# Altium schematic sheet External_Camera_HAT_Connectors.SchDoc: Connectors
size B; Date: 12/28/2023; Author: Robert Pafford; Organization: ORGANIZATION; Address1: ADDRESS 1; Address2: ADDRESS 2; Address3: ADDRESS 3; Address4: ADDRESS 4; Revision: -; SheetNumber: 1; SheetTotal: 4; ENG_APP_DATE: --/--/--; DSN_APP_DATE: --/--/--; CHK_APP_DATE: --/--/--
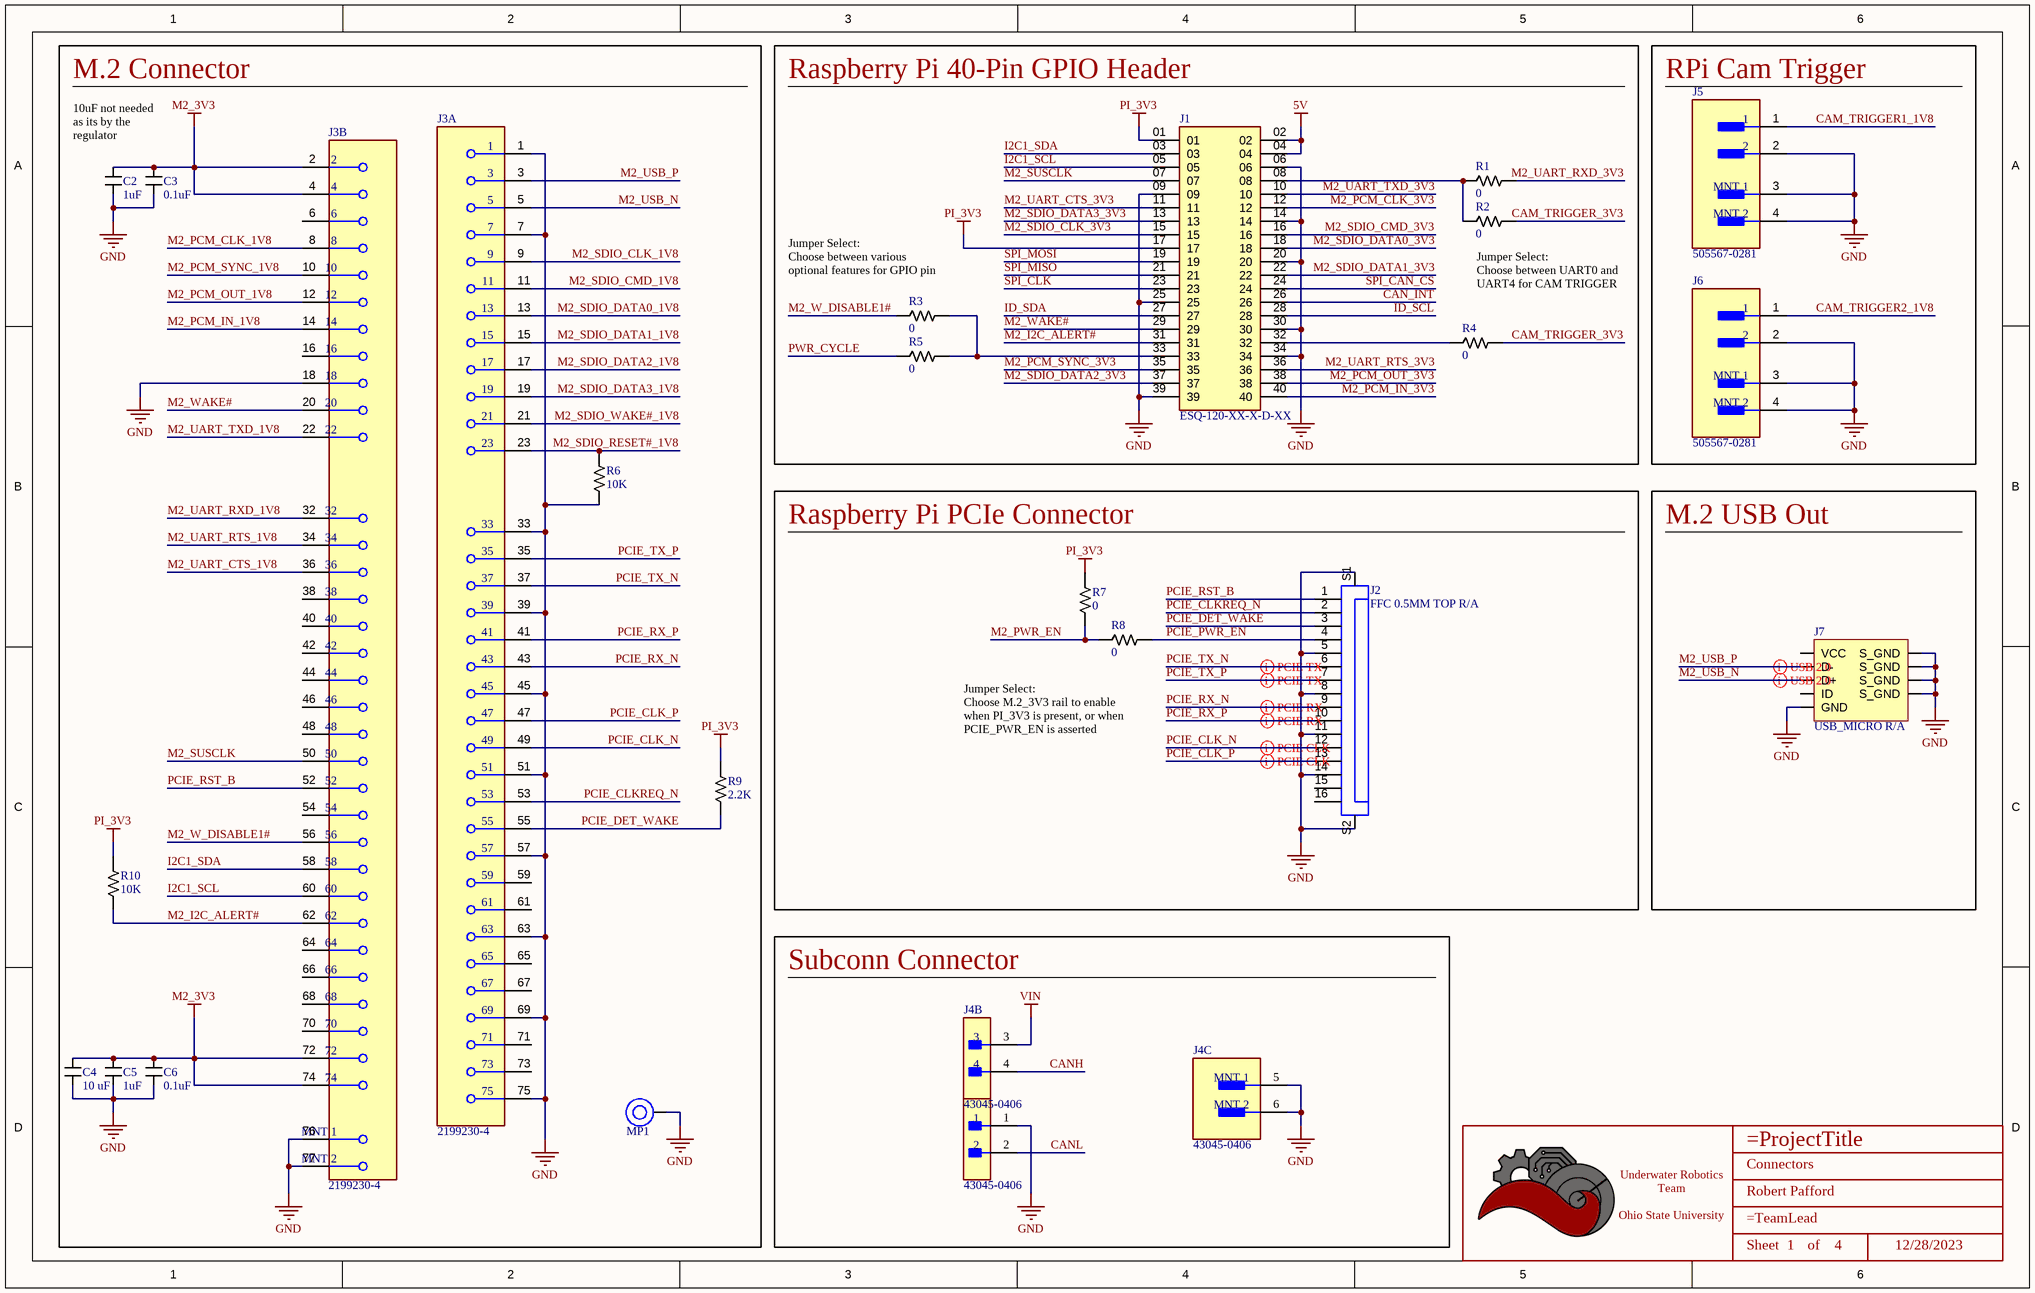
[diagram p0: External_Camera_HAT_Connectors.SchDoc]

## Parts
*  Title_Block  [LOGO]  (value not drawn)  (graphical)
C2  value 1uF  [CAPACITOR_0402]  (hidden comment: 1uF Ceramic 16V)
C3  value 0.1uF  [CAPACITOR_0402]  (hidden comment: 100nF Ceramic 25V)
C4  Value (uF): 10 uF  [CAPACITOR_0603]  (hidden comment: 10uF Ceramic 6.3V)
C5  value 1uF  [CAPACITOR_0402]  (hidden comment: 1uF Ceramic 16V)
C6  value 0.1uF  [CAPACITOR_0402]  (hidden comment: 100nF Ceramic 25V)
J1  ESQ-120-XX-X-D-XX  [SAMTEC_ESQ-120-XX-X-D-XX]
J2  FFC 0.5MM TOP R/A  [FH12A-16S-0.5SH(55)]
J3  2199230-4  [FP-2199230-4-MFG]  (parts A,B of 2)
J4  43045-0406  [FP-43045-0406-MFG]  (parts A,B,C of 3)
J5  505567-0281  [FP-505567-0281-MFG]
J6  505567-0281  [FP-505567-0281-MFG]
J7  USB_MICRO R/A  [CONN_MINIUSB]
MP1  M3 x 2.5mm  [78614025360]  (value not drawn)
R1  Value  (Ohms): 0  [RESISTOR_0402]  (hidden comment: 0 Ohm 1% 1/16W)
R2  Value  (Ohms): 0  [RESISTOR_0402]  (hidden comment: 0 Ohm 1% 1/16W)
R3  Value  (Ohms): 0  [RESISTOR_0402]  (hidden comment: 0 Ohm 1% 1/16W)
R4  Value  (Ohms): 0  [RESISTOR_0402]  (hidden comment: 0 Ohm 1% 1/16W)
R5  Value  (Ohms): 0  [RESISTOR_0402]  (hidden comment: 0 Ohm 1% 1/16W)
R6  Value  (Ohms): 10K  [RESISTOR_0402]  (hidden comment: 10k Ohm 1% 1/16W)
R7  Value  (Ohms): 0  [RESISTOR_0402]  (hidden comment: 0 Ohm 1% 1/16W)
R8  Value  (Ohms): 0  [RESISTOR_0402]  (hidden comment: 0 Ohm 1% 1/16W)
R9  Value  (Ohms): 2.2K  [RESISTOR_0402]  (hidden comment: 2.2k Ohm 1% 1/16W)
R10  Value  (Ohms): 10K  [RESISTOR_0402]  (hidden comment: 10k Ohm 1% 1/16W)

## Blocks framed on the sheet
M.2 Connector: C2-C6 J3 MP1 R6 R9 R10
Raspberry Pi 40-Pin GPIO Header: J1 R1-R5
RPi Cam Trigger: J5 J6
Raspberry Pi PCIe Connector: J2 R7 R8
M.2 USB Out: J7
Subconn Connector: J4

## Nets
5V: J1.02 J1.04
GND: C2.2 C3.2 C4.2 C5.2 C6.2 J1.06 J1.09 J1.14 J1.20 J1.25 J1.30 J1.34 J1.39 J2.5 J2.8 J2.11 J2.14 J2.S1 J2.S2 J3.1 J3.7 J3.18 J3.33 J3.39 J3.45 J3.51 J3.57 J3.63 J3.69 J3.75 J3.76(MNT_1) J3.77(MNT_2) J4.1 J4.5(MNT_1) J4.6(MNT_2) J5.2 J5.3(MNT_1) J5.4(MNT_2) J6.2 J6.3(MNT_1) J6.4(MNT_2) J7.5(GND) J7.6(S_GND) J7.7(S_GND) J7.8(S_GND) J7.9(S_GND) MP1.1 R6.2
M2_3V3: C2.1 C3.1 C4.1 C5.1 C6.1 J3.2 J3.4 J3.72 J3.74
PI_3V3: J1.01 J1.17 R7.1 R9.1 R10.1
VIN: J4.3
CAM_TRIGGER1_1V8: J5.1
CAM_TRIGGER2_1V8: J6.1
CAM_TRIGGER_3V3: R2.1 R4.1
CAN_INT: J1.26
CANH: J4.4
CANL: J4.2
I2C1_SCL: J1.05 J3.60
I2C1_SDA: J1.03 J3.58
ID_SCL: J1.28
ID_SDA: J1.27
M2_I2C_ALERT#: J1.31 J3.62 R10.2
M2_PCM_CLK_1V8: J3.8
M2_PCM_CLK_3V3: J1.12
M2_PCM_IN_1V8: J3.14
M2_PCM_IN_3V3: J1.40
M2_PCM_OUT_1V8: J3.12
M2_PCM_OUT_3V3: J1.38
M2_PCM_SYNC_1V8: J3.10
M2_PCM_SYNC_3V3: J1.35
M2_PWR_EN: R7.2 R8.2
M2_SDIO_CLK_1V8: J3.9
M2_SDIO_CLK_3V3: J1.15
M2_SDIO_CMD_1V8: J3.11
M2_SDIO_CMD_3V3: J1.16
M2_SDIO_DATA0_1V8: J3.13
M2_SDIO_DATA0_3V3: J1.18
M2_SDIO_DATA1_1V8: J3.15
M2_SDIO_DATA1_3V3: J1.22
M2_SDIO_DATA2_1V8: J3.17
M2_SDIO_DATA2_3V3: J1.37
M2_SDIO_DATA3_1V8: J3.19
M2_SDIO_DATA3_3V3: J1.13
M2_SDIO_RESET#_1V8: J3.23 R6.1
M2_SDIO_WAKE#_1V8: J3.21
M2_SUSCLK: J1.07 J3.50
M2_UART_CTS_1V8: J3.36
M2_UART_CTS_3V3: J1.11
M2_UART_RTS_1V8: J3.34
M2_UART_RTS_3V3: J1.36
M2_UART_RXD_1V8: J3.32
M2_UART_RXD_3V3: R1.1
M2_UART_TXD_1V8: J3.22
M2_UART_TXD_3V3: J1.10
M2_USB_N: J3.5 J7.3(D+)
M2_USB_P: J3.3 J7.2(D-)
M2_W_DISABLE1#: J3.56 R3.2
M2_WAKE#: J1.29 J3.20
PCIE_CLK_N: J2.12 J3.49
PCIE_CLK_P: J2.13 J3.47
PCIE_CLKREQ_N: J2.2 J3.53
PCIE_DET_WAKE: J2.3 J3.55 R9.2
PCIE_PWR_EN: J2.4 R8.1
PCIE_RST_B: J2.1 J3.52
PCIE_RX_N: J2.9 J3.43
PCIE_RX_P: J2.10 J3.41
PCIE_TX_N: J2.6 J3.37
PCIE_TX_P: J2.7 J3.35
PWR_CYCLE: R5.2
SPI_CAN_CS: J1.24
SPI_CLK: J1.23
SPI_MISO: J1.21
SPI_MOSI: J1.19
NetJ1_08: J1.08 R1.2 R2.2
NetJ1_32: J1.32 R4.2
NetJ1_33: J1.33 R3.1 R5.1

Not connected (* = marked no-connect by the designer): J2 15 16; J3 6 16 38 40 42 44 46 48 54 59 61 64 65 66 67 68 70 71 73; J7 1(VCC) 4(ID)

## Layout directives
differential pair; differential pair class USB 2.0: M2_USB_N, M2_USB_P
differential pair; differential pair class PCIe Gen 2: PCIE_CLK_N, PCIE_CLK_P, PCIE_RX_N, PCIE_RX_P, PCIE_TX_N, PCIE_TX_P

## Notes on the sheet
- 10uF not needed as its by the regulator
- (near R3) Jumper Select:
  Choose between various optional features for GPIO pin
- Jumper Select:
  Choose between UART0 and UART4 for CAM TRIGGER
- (near R8) Jumper Select:
  Choose M.2_3V3 rail to enable when PI_3V3 is present, or when PCIE_PWR_EN is asserted
- DWG. NO.
- REV.
- SHT.
- THIS DOCUMENT AND THE DATA DISCLOSED HEREIN OR HEREWITH IS THE PROPERTY OF ALTIUM LIMITED AND MAY BE FREELY DISTRIBUTED IN WHOLE. NO RIGHTS ARE RESERVED OR EXPRESS OR IMPLIED WARANTEE GIVEN.
- REVISION
- DESCRIPTION
- DATE
- APPROVED
- ENG:
- APPROVALS
- PROJECT
- DSN:
- CHK:
- REFERENCE DOCUMENTS
- PROJECT REVISION:
- TITLE
- DOCUMENT REVISION:
- DESIGN ITEM:
- BOM:
- FAB DWG:
- PCB DWG:
- ASSY DWG:
- SCALE:
- SIZE
- B
- CAGE CODE
- FILE NAME
- DWG NO.
- SHEET
- OF
- REV
- (in symbol Title_Block) Underwater Robotics Team / Ohio State University; Sheet; of

## Library data of the parts
* = Title_Block: UWRT Schematic Title Block Template / Created June 2021, Dylan Trainor
C2 C5 = CAPACITOR_1uF_0402: Cap 1uF 16V +/-10% / Ceramic 0402; Made By: Robert Pafford; Tolerance: +/- 10%; Voltage: 16V; Supplier 1: Digi-Key; Supplier Part Number 1: 478-0402YD105KAT4ADKR-ND
C3 C6 = CAPACITOR_0.1uF_0402: Cap 100nF 25V +/-10% / Ceramic 0402; Made By: Robert Pafford; Tolerance: +/- 10%; Voltage: 25V; Supplier 1: Digi-Key; Supplier Part Number 1: 478-7868-1-ND
C4 = CAPACITOR_10uF_0603: Cap 10uF 6.3V +/-20% / Ceramic 0603; Made By: Flip B; ComponentLink1Description: Digikey; ComponentLink1URL: https://www.digikey.com/en/products/detail/samsung-electro-mechanics/CL10A106MQ8NNNC/3886777; Supplier 1: Digi-Key; Supplier Part Number 1: 1276-1119-1-ND; Tolerance: +/- 20%; Voltage: 6.3V
J1 = ESQ-120-XX-X-D-XX: ESQ - Samtec 2.54mm Elevated Dual Row Socket Strip 7.36mm Contact. 11.05mm Profile (13); MP: ESQ-120-13-L-D; Price: None; Purchase-URL: https://pricing.snapeda.com/search/part/ESQ-120-13-L-D/?ref=eda; Package: None; Check_prices: https://www.snapeda.com/parts/ESQ-120-13-L-D/Samtec+Inc./view-part/?ref=eda; Value: *; Availability: In Stock; MF: Samtec; SnapEDA_Link: https://www.snapeda.com/parts/ESQ-120-13-L-D/Samtec+Inc./view-part/?ref=snap; Supplier 1: Digikey; Supplier Part Number 1: SAM9318-ND
J2 = FFC_16POS_0.5MM_R/A_TOP: 16 Position FPC Connector Contacts, Top 0.02" (0.5mm) Surface Mount, Right Angle, Gold Contacts; Made By: Robert Pafford; Max Current: 0.5A; FFC Type: ZIF Locking; Orientation: Top R/A; Pin Count: 16; Contact Plating: Gold; Supplier 1: Digi-Key; Supplier Part Number 1: HFK116CT-ND
J3 = CMP-03365-000002-1: CONN FEMALE 67POS 0.020 GOLD; Manufacturer: TE Connectivity; Conn Orientation: Right Angle; Pitch: 0.5mm; Number Of Contacts: 67; Voltage Rating: 50V; Is Female: yes; Current Rating: 0.5A; Lead Free: Yes; Temperature Range Low: -40°C; Device Class L3: unset; Package: 0; Manufacturer Part Number: 2199230-4; RoHS: TRUE; Digikey Description: CONN FEMALE 67POS 0.020 GOLD; Category: Conn; Device Class L1: Connectors; Temperature Range High: +80°C; ComponentLink2Description: Datasheet; ComponentLink2URL: https://www.te.com/commerce/DocumentDelivery/DDEController?Action=showdoc&DocId=Customer+Drawing%7F2199230%7FB3%7Fpdf%7FEnglish%7FENG_CD_2199230_B3.pdf%7F2199230-4; Mouser Description: PCI Express / PCI Connectors .5PITCH 4.2H KEY E EMBOSS NGFF MINICARD; Automotive: No; Conn Gender: Female; Height: 4.2mm; Device Class L2: Card Edge Connectors; Contact Material: Gold,Nickel; Number Of Rows: 2; Octopart: https://octopart.com/2199230-4-te+connectivity-46436156; Temperature: -40°C to +80°C
J4 = CMP-04776-000244-1: CONN HEADER SMD R/A 4POS 3MM; Max Voltage Rating (DC): 250.25kV; Contact Resistance: 10mR; Glow Wire Compliant: Compliant; Current Rating: 5A; Number of Contacts: 4; Gender: Male; Voltage Rating: 600V; Voltage Rating (DC): 250V; Min Operating Temperature: -40°C; Mount: Surface Mount; Contact Material: Brass; Number of Rows: 2; Flammability Rating: UL94 V-0; Series: Micro-Fit 3.0; Termination: SMD/SMT; Packaging: Tape and Reel; Row Spacing: 3mm; Contact Plating: Tin; Case/Package: 0406; Package Quantity: 1800; Number of Circuits: 4; Halogen Free: Low Halogen; Pitch: 3mm; Max Operating Temperature: 105°C; RoHS Compliant: Yes; Housing Material: Thermoplastic; Color: Black; Number of Positions: 4; Orientation: Right Angle
J5 J6 = CMP-04776-000725-1: CONN HEADER SMD R/A 2POS 1.25MM
J7 = CONN_MICROUSB: Amphenol Micro USB-B / USB2.0 5 Pin Right Angle SMD; Pitch: 0.65mm; Current Per Pin: 1.8A; Number of Positions: 5; Manufacturer: Amphenol; Configuration: Right Angle; Color: Silver; Created By: Flip B; ComponentLink1Description: Datasheet; ComponentLink1URL: https://cdn.amphenol-icc.com/media/wysiwyg/files/documentation/datasheet/inputoutput/io_usb_micro.pdf?__cf_chl_jschl_tk__=05693735e19256298f6ef6ca2bb2e65c376a4f56-1625503833-0-Abitsb0-ufjOXJYs_S3J3r2iTn-nObalbmXUksF1VvO_h_WEmRdMlUD1I8-hmWSEVWzY1pirKnrPZWfgY3851qyBZe5ZvnNQePLGIzUgdEIQBVUyW36RsbYpDLEWxJ4horD-5gChFgobLYqwmG5aHl0E8lIn_twwPPrOxilK2gP0q9t_CNOs_u5fMqXvXUrlsOv8tIE2NRlu6NVP8qtkL2GjhlkeTUbDMF8WvvpPDTFOgvZ4Y16Ej8F8AhWos88mo5B1HssXozw0XrkJQIqERITUu6rqloz9kf4ZzhBHtDAt-IkiAFY_Ds9SW8FYKKTtINJVpHZQ6Gyu1FFM4Dc9MO0maE8_mmNcwlxqyRoRk_MPWW8VyByXWM5RSp52jteRKw7FeI9WIYvCbPAOy0Eyib-aseIQsnGbglBcUY6_2xp8GYaJM38H3dNvBPsSOfJBPndKedwKHllxjkucXn6xsN0sDXkpGN-cu8_2bDTJ0g-uUucKSCooYX-ApSDNGpkA_p9zv1SOAD8c0zaZVmtiBsN75QpVz2rzq9_BFxOywPvR; Series: 10118192; Supplier 1: Digi-Key; Supplier Part Number 1: 609-4613-1-ND
MP1 = M3_STANDOFF_78614025360: WE-SMSA SMT Spacer Studs Automotive, OD 6mm, ID 4.2mm, M3 x 2.5mm; Manufacturer: Wurth Elektronik; Solder Cream Thickness Min: 150µm; Surface: Tin; Tightenning Torque Max: 0.5N*m; ComponentLink1Description: Website Link; ComponentLink1URL: https://www.we-online.com/redexpert/article/78614025360?ad; ComponentLink2Description: Datasheet Link; ComponentLink2URL: https://www.we-online.com/redexpert/spec/78614025360?ad; Manufacturer Part Number: 78614025360; Category: Assembly; Match Code: WE-SMSA; Mount: Surface Mount; Operating Temperature Max: 150°C; Operating Temperature Min: -55°C; Packaging: Tape and Reel; Height: 2.5mm; Inner Diameter: 4.2mm; Outer Diameter: 6mm; Material: Steel; Thread: M3; Supplier 1: Digikey; Supplier Part Number 1: 732-78614025360CT-ND
R1-R5 R7 R8 = RESISTOR_0_0402: RES 0 OHM 1% 1/16W 0402; Tolerance: +/- 1%; Made By: Robert Pafford; Wattage: 1/16W; Supplier 1: Digikey; Supplier Part Number 1: 13-AC0402FR-070RLCT-ND
R6 R10 = RESISTOR_10K_0402: RES 10k OHM 1% 1/16W 0402; Tolerance: +/- 1%; Made By: Robert Pafford; Wattage: 1/16W; Supplier: Digikey; Digikey Part Numer: CR0603-JW-104ELFTR-ND; Supplier 1: Digi-Key; Supplier Part Number 1: YAG3436CT-ND
R9 = RESISTOR_2.2K_0402: RES 2.2K OHM 1% 1/16W 0402; Tolerance: +/- 1%; Made By: Megan McCabe; Wattage: 1/16W; Supplier 1: Digikey; Supplier Part Number 1: 311-2.20KLRCT-ND